# Altium schematic sheet Test_Points.SchDoc: Test Points
size A4; DocumentNumber: 21; SheetNumber: 21; SheetTotal: 50
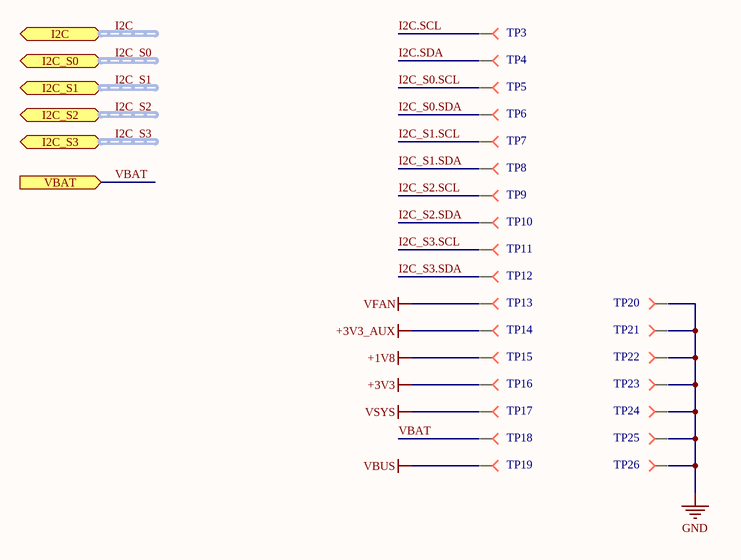
[diagram p0: Test_Points.SchDoc]

## Parts
TP3  Test Point Pad  [Testpoint]  (value not drawn)  (no BOM)
TP4  Test Point Pad  [Testpoint]  (value not drawn)  (no BOM)
TP5  Test Point Pad  [Testpoint]  (value not drawn)  (no BOM)
TP6  Test Point Pad  [Testpoint]  (value not drawn)  (no BOM)
TP7  Test Point Pad  [Testpoint]  (value not drawn)  (no BOM)
TP8  Test Point Pad  [Testpoint]  (value not drawn)  (no BOM)
TP9  Test Point Pad  [Testpoint]  (value not drawn)  (no BOM)
TP10  Test Point Pad  [Testpoint]  (value not drawn)  (no BOM)
TP11  Test Point Pad  [Testpoint]  (value not drawn)  (no BOM)
TP12  Test Point Pad  [Testpoint]  (value not drawn)  (no BOM)
TP13  Test Point Pad  [Testpoint]  (value not drawn)  (no BOM)
TP14  Test Point Pad  [Testpoint]  (value not drawn)  (no BOM)
TP15  Test Point Pad  [Testpoint]  (value not drawn)  (no BOM)
TP16  Test Point Pad  [Testpoint]  (value not drawn)  (no BOM)
TP17  Test Point Pad  [Testpoint]  (value not drawn)  (no BOM)
TP18  Test Point Pad  [Testpoint]  (value not drawn)  (no BOM)
TP19  Test Point Pad  [Testpoint]  (value not drawn)  (no BOM)
TP20  Test Point Pad  [Testpoint]  (value not drawn)  (no BOM)
TP21  Test Point Pad  [Testpoint]  (value not drawn)  (no BOM)
TP22  Test Point Pad  [Testpoint]  (value not drawn)  (no BOM)
TP23  Test Point Pad  [Testpoint]  (value not drawn)  (no BOM)
TP24  Test Point Pad  [Testpoint]  (value not drawn)  (no BOM)
TP25  Test Point Pad  [Testpoint]  (value not drawn)  (no BOM)
TP26  Test Point Pad  [Testpoint]  (value not drawn)  (no BOM)

## Ports
I2C (harness I2C), I2C_S0 (harness I2C), I2C_S1 (harness I2C), I2C_S2 (harness I2C), I2C_S3 (harness I2C), VBAT (in)

## Nets
+1V8: TP15.1
+3V3: TP16.1
+3V3_AUX: TP14.1
GND: TP20.1 TP21.1 TP22.1 TP23.1 TP24.1 TP25.1 TP26.1
VBUS: TP19.1
VFAN: TP13.1
VSYS: TP17.1
I2C.SCL: TP3.1
I2C.SDA: TP4.1
I2C_S0.SCL: TP5.1
I2C_S0.SDA: TP6.1
I2C_S1.SCL: TP7.1
I2C_S1.SDA: TP8.1
I2C_S2.SCL: TP9.1
I2C_S2.SDA: TP10.1
I2C_S3.SCL: TP11.1
I2C_S3.SDA: TP12.1
VBAT: TP18.1 ; port VBAT

## Buses and harness runs
harness I2C = port I2C
harness I2C_S0 = port I2C_S0
harness I2C_S1 = port I2C_S1
harness I2C_S2 = port I2C_S2
harness I2C_S3 = port I2C_S3

## Notes on the sheet
- Title
- Size:
- Date:
- A4
- Number:
- Time:
- Revision:
- Sheet
- of
- File:

## Library data of the parts
TP3-TP26 = Test Point Pad: Test Point. There is nothing to buy or mount.; ClassName: TestPoint; CompType: TestPoint; Manufacturer: N/A; MountType: N/A; PackageReference: TetsPoint; PartNumber: N/A